# EAGLE design rc2014_16550b (EAGLE 8.1.1)
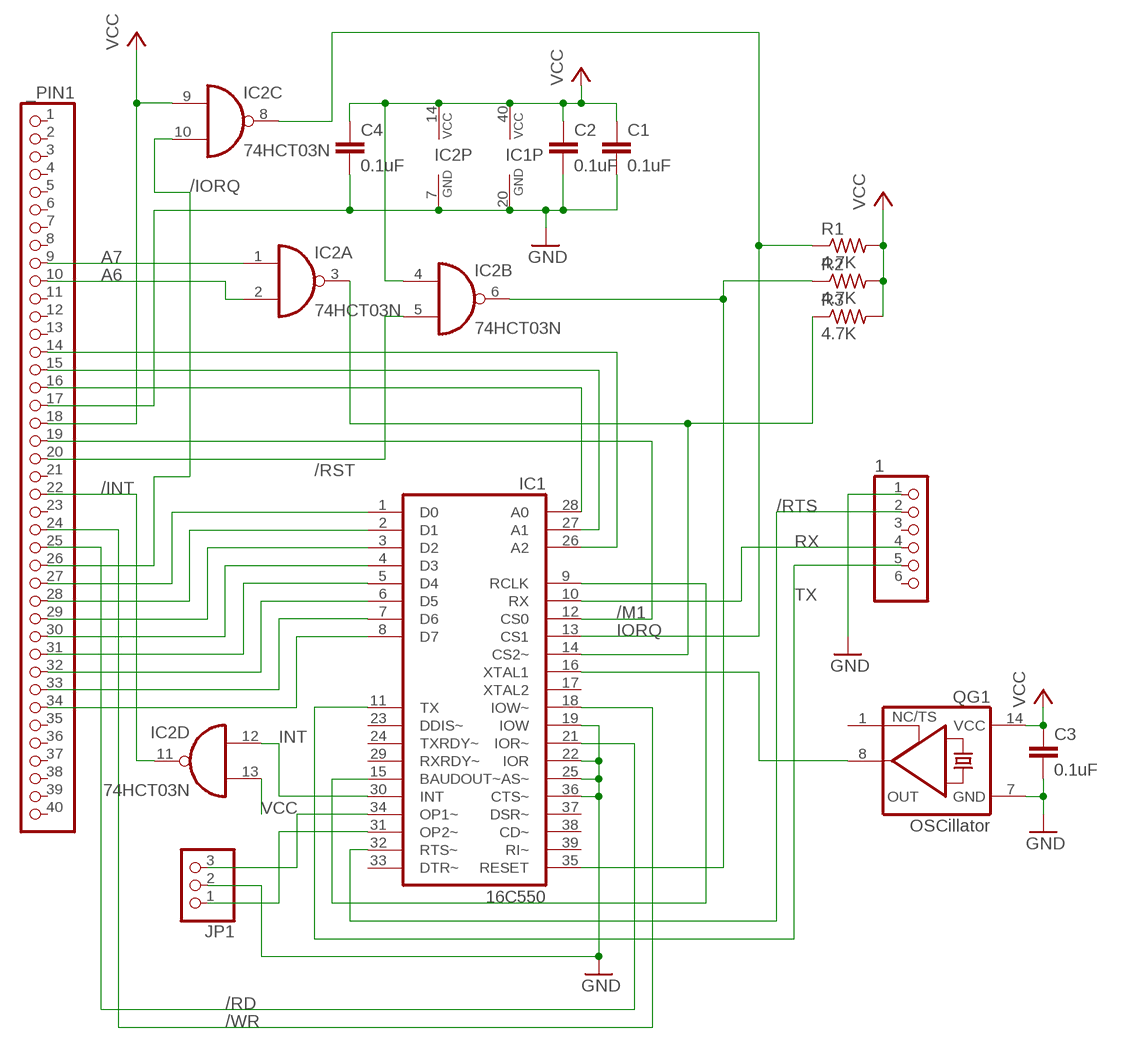
[diagram p0: schematic, sheet 1]

## Parts
1  PINHD-1X6  [1X06]
_PIN1  PINHD-1X40  [1X40]
C1  0.1uF  C-EU050-024X044  [C050-024X044]
C2  0.1uF  C-EU050-024X044  [C050-024X044]
C3  0.1uF  C-EU050-024X044  [C050-024X044]
C4  0.1uF  C-EU050-024X044  [C050-024X044]
IC1  16C550  XR-16C550P  [DIL40]
IC2  74HCT03N  74HCT00N  [DIL14]
JP1  PINHD-1X3  [1X03]
QG1  OSCillator  XO-14  [DIL14S]
R1  4.7K  R-US_0207/10  [0207/10]
R2  4.7K  R-US_0207/10  [0207/10]
R3  4.7K  R-US_0207/10  [0207/10]

## Nets
/CS2: IC1.14(CS2~) IC2.3(A:O) R3.1
/INT: _PIN1.22 IC2.11(D:O)
/IORQ: _PIN1.26 IC2.10(C:I1)
/M1: _PIN1.19 IC1.12(CS0)
/RD: _PIN1.25 IC1.21(IOR~)
/RST: _PIN1.20 IC2.5(B:I1)
/RTS: 1.2 IC1.32(RTS~)
/WR: _PIN1.24 IC1.18(IOW~)
A0: _PIN1.16 IC1.28(A0)
A1: _PIN1.15 IC1.27(A1)
A2: _PIN1.14 IC1.26(A2)
A6: _PIN1.10 IC2.2(A:I1)
A7: _PIN1.9 IC2.1(A:I0)
D0: _PIN1.27 IC1.1(D0)
D1: _PIN1.28 IC1.2(D1)
D2: _PIN1.29 IC1.3(D2)
D3: _PIN1.30 IC1.4(D3)
D4: _PIN1.31 IC1.5(D4)
D5: _PIN1.32 IC1.6(D5)
D6: _PIN1.33 IC1.7(D6)
D7: _PIN1.34 IC1.8(D7)
GND: 1.1 _PIN1.17 C1.2 C2.2 C3.2 C4.2 IC1.19(IOW) IC1.20(GND) IC1.22(IOR) IC1.25(AS~) IC1.36(CTS~) IC2.7(P:GND) JP1.2 QG1.7(GND)
INT: IC1.30(INT) IC2.12(D:I0)
IORQ: IC1.13(CS1) IC2.8(C:O) R1.1
N$1: IC1.34(OP1~) JP1.3
N$2: IC1.31(OP2~) JP1.1
N$14: IC1.9(RCLK) IC1.15(BAUDOUT~)
OSC: IC1.16(XTAL1) QG1.8(OUT)
RESET: IC1.35(RESET) IC2.6(B:O) R2.1
RX: 1.4 IC1.10(RX)
TX: 1.5 IC1.11(TX)
VCC: _PIN1.18 C1.1 C2.1 C3.1 C4.1 IC1.40(VCC) IC2.4(B:I0) IC2.9(C:I0) IC2.13(D:I1) IC2.14(P:VCC) QG1.14(VCC) R1.2 R2.2 R3.2
Unconnected: 1.3 1.6 _PIN1.1 _PIN1.2 _PIN1.3 _PIN1.4 _PIN1.5 _PIN1.6 _PIN1.7 _PIN1.8 _PIN1.11 _PIN1.12 _PIN1.13 _PIN1.21 _PIN1.23 _PIN1.35 _PIN1.36 _PIN1.37 _PIN1.38 _PIN1.39 _PIN1.40 IC1.17(XTAL2) IC1.23(DDIS~) IC1.24(TXRDY~) IC1.29(RXRDY~) IC1.33(DTR~) IC1.37(DSR~) IC1.38(CD~) IC1.39(RI~) QG1.1(TS)

## Library data of the parts
1 = pinhead:PINHD-1X6: PIN HEADER
_PIN1 = pinhead:PINHD-1X40: PIN HEADER
C1-C4 = rcl:C-EU: CAPACITOR, European symbol
IC1 = exar:XR-16C550P: UART/FIFO; MPN: ST16C450CP40; OC_FARNELL: 1294801; OC_NEWARK: 24R1445
IC2 = 74xx-eu:74*00: Quad 2-input NAND gate
JP1 = pinhead:PINHD-1X3: PIN HEADER
QG1 = crystal:XO-: CRYSTAL; OC_FARNELL: unknown; OC_NEWARK: unknown
R1-R3 = rcl:R-US_: RESISTOR, American symbol

## Net classes
0 +5V: width 0.508 mm

## Board
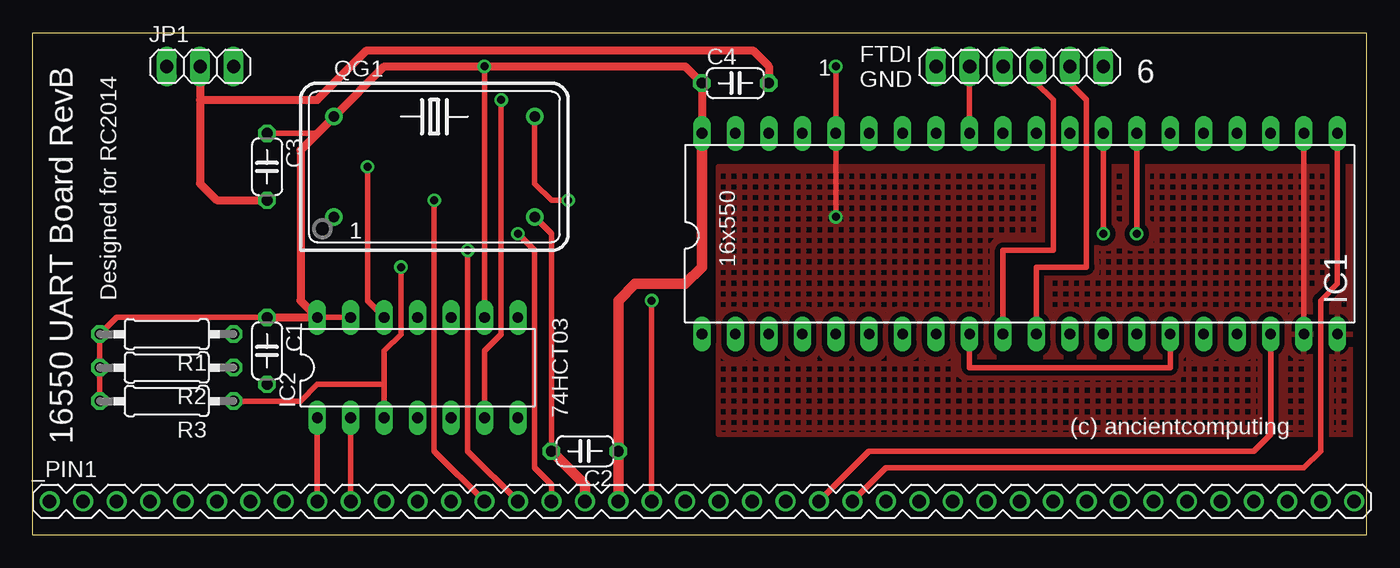
[diagram p1: board, top side]
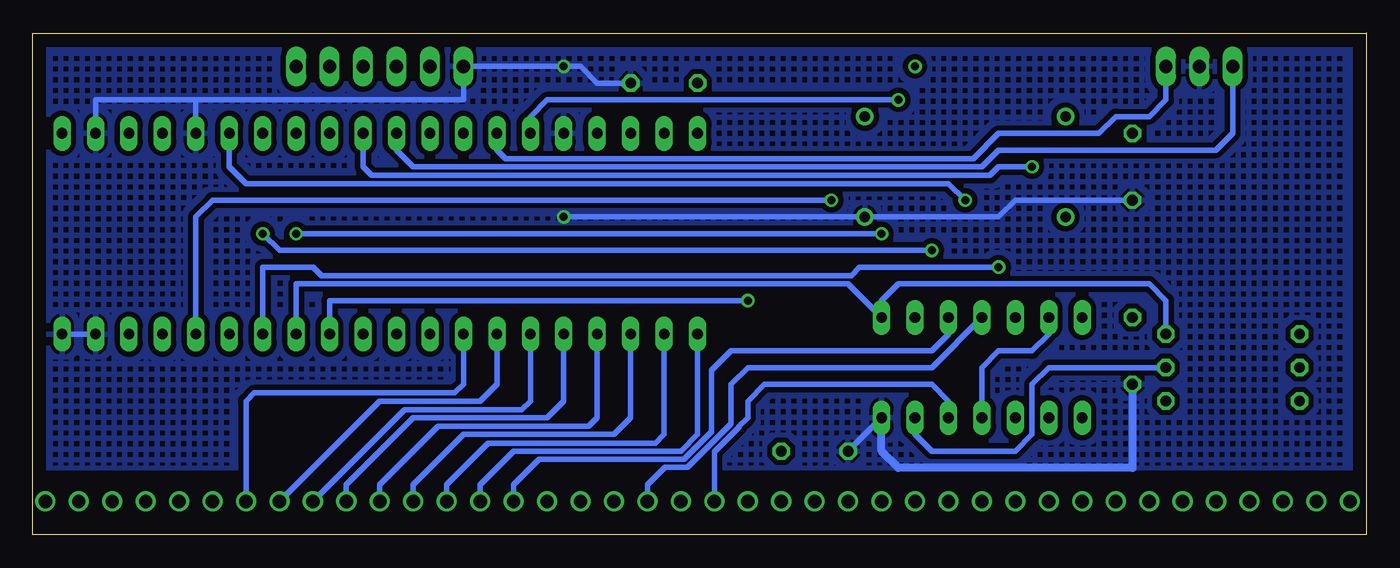
[diagram p2: board, bottom side, seen from below]

Size 101.27 x 38.1 mm. Coordinates in mm from the lower left corner, seen from the top.
Outline: 0,38.09 101.27,38.09 101.27,0 0,0 0,38.09
Outline: 0,38.09 0,38.1
Copper layers (1*16): Top 0.035mm / dielectric 1.5mm / Bottom 0.035mm
Design rules "default *": minimum track width 20mil, minimum drill 24mil, track to track 8mil, track to pad 8mil, pad to pad 8mil, via to via 8mil, smd to smd 8mil, copper to edge 40mil, drill to drill 8mil, minimum pad ring 10mil, minimum via ring 8mil, stop-mask expansion 4mil, vias tented up to drill 0mil, thermal gap 10mil

### Footprints (pad centres in the part's own frame; a part is rotated, then mirrored left to right if it is on the bottom)
1X06 = drill 1.016 long: 1 -6.35,0; 2 -3.81,0; 3 -1.27,0; 4 1.27,0; 5 3.81,0; 6 6.35,0
1X40 = drill 1.016: 1 -49.53,0; 2 -46.99,0; 3 -44.45,0; 4 -41.91,0; 5 -39.37,0; 6 -36.83,0; 7 -34.29,0; 8 -31.75,0; 9 -29.21,0; 10 -26.67,0; 11 -24.13,0; 12 -21.59,0; 13 -19.05,0; 14 -16.51,0; 15 -13.97,0; 16 -11.43,0; 17 -8.89,0; 18 -6.35,0; 19 -3.81,0; 20 -1.27,0; 21 1.27,0; 22 3.81,0; 23 6.35,0; 24 8.89,0; 25 11.43,0; 26 13.97,0; 27 16.51,0; 28 19.05,0; 29 21.59,0; 30 24.13,0; 31 26.67,0; 32 29.21,0; 33 31.75,0; 34 34.29,0; 35 36.83,0; 36 39.37,0; 37 41.91,0; 38 44.45,0; 39 46.99,0; 40 49.53,0
C050-024X044 = drill 0.813 octagon: 1 -2.54,0; 2 2.54,0
DIL40 = drill 0.813 long: 1 -24.13,-7.62; 2 -21.59,-7.62; 3 -19.05,-7.62; 4 -16.51,-7.62; 5 -13.97,-7.62; 6 -11.43,-7.62; 7 -8.89,-7.62; 8 -6.35,-7.62; 9 -3.81,-7.62; 10 -1.27,-7.62; 11 1.27,-7.62; 12 3.81,-7.62; 13 6.35,-7.62; 14 8.89,-7.62; 15 11.43,-7.62; 16 13.97,-7.62; 17 16.51,-7.62; 18 19.05,-7.62; 19 21.59,-7.62; 20 24.13,-7.62; 21 24.13,7.62; 22 21.59,7.62; 23 19.05,7.62; 24 16.51,7.62; 25 13.97,7.62; 26 11.43,7.62; 27 8.89,7.62; 28 6.35,7.62; 29 3.81,7.62; 30 1.27,7.62; 31 -1.27,7.62; 32 -3.81,7.62; 33 -6.35,7.62; 34 -8.89,7.62; 35 -11.43,7.62; 36 -13.97,7.62; 37 -16.51,7.62; 38 -19.05,7.62; 39 -21.59,7.62; 40 -24.13,7.62
DIL14 = drill 0.813 long: 1 -7.62,-3.81; 2 -5.08,-3.81; 3 -2.54,-3.81; 4 0,-3.81; 5 2.54,-3.81; 6 5.08,-3.81; 7 7.62,-3.81; 8 7.62,3.81; 9 5.08,3.81; 10 2.54,3.81; 11 0,3.81; 12 -2.54,3.81; 13 -5.08,3.81; 14 -7.62,3.81
1X03 = drill 1.016 long: 1 -2.54,0; 2 0,0; 3 2.54,0
DIL14S = drill 0.813: 1 -7.62,-3.81; 7 7.62,-3.81; 8 7.62,3.81; 14 -7.62,3.81
0207/10 = drill 0.813 octagon: 1 -5.08,0; 2 5.08,0

### Placement (x,y rotation side)
1  74.93,35.56 0 top
_PIN1  50.8,2.54 0 top
C1  17.78,13.97 270 top
C2  41.91,6.35 180 top
C3  17.78,27.94 270 top
C4  53.34,34.29 0 top
IC1  74.93,22.86 0 top
IC2  74HCT00N  [DIL14]  29.21,12.7 0 top
JP1  12.7,35.56 0 top
QG1  30.48,27.94 0 top
R1  [0207/10]  10.16,15.24 180 top
R2  [0207/10]  10.16,12.7 180 top
R3  [0207/10]  10.16,10.16 180 top

### Tracks (layer width: path | path; a pad name or v marks a point on that pad's centre or on a via)
/CS2  (via drill 0.61)
  Top 0.406: 26.67,11.43 IC2.3 | 26.67,11.43 26.67,13.97 27.94,15.24 v27.94,20.32 | 26.67,11.43 21.59,11.43 20.32,10.16 R3.1
  Bottom 0.406: v27.94,20.32 38.51,20.32 39.12,19.66 79.35,19.66 80.01,20.32 83.82,20.32 IC1.14
/INT
  Bottom 0.406: _PIN1.22 54.61,3.81 53.29,5.13 51.56,5.13 48.26,8.44 48.26,11.43 46.99,12.7 33.02,12.7 IC2.11
/IORQ
  Bottom 0.406: _PIN1.26 64.77,3.81 62.84,5.74 51.82,5.74 49.73,7.83 49.73,12.5 48.26,13.97 33.02,13.97 31.75,15.24 IC2.10
/M1  (via drill 0.61)
  Top 0.406: _PIN1.19 v46.99,17.78
  Bottom 0.406: v46.99,17.78 78.74,17.78 IC1.12
/RD
  Top 0.406: _PIN1.25 64.77,5.08 96.52,5.08 97.79,6.35 97.79,17.78 99.06,19.05 IC1.21
/RST
  Bottom 0.406: _PIN1.20 49.53,6.3 47.65,8.18 47.65,8.23 46.99,8.89 46.99,10.16 45.72,11.43 33.02,11.43 31.75,10.16 IC2.5
/RTS
  Top 0.406: 1.2 IC1.32
/WR
  Top 0.406: _PIN1.24 63.5,6.35 92.71,6.35 93.98,7.62 IC1.18
A0  (via drill 0.61)
  Top 0.406: IC1.28 v81.28,22.86 | _PIN1.16 39.37,3.81 38.1,5.08 38.1,21.59 v36.83,22.86
  Bottom 0.406: v36.83,22.86 v81.28,22.86
A1  (via drill 0.61)
  Top 0.406: IC1.27 v83.82,22.86 | _PIN1.15 33.02,6.35 v33.02,21.59
  Bottom 0.406: v83.82,22.86 82.55,21.59 v33.02,21.59
A2  (via drill 0.61)
  Top 0.406: _PIN1.14 30.48,6.35 v30.48,25.4
  Bottom 0.406: v30.48,25.4 31.75,26.67 85.09,26.67 86.36,27.94 IC1.26
A6
  Top 0.406: _PIN1.10 IC2.2
A7
  Top 0.406: _PIN1.9 IC2.1
D0
  Bottom 0.406: _PIN1.27 67.31,3.81 64.77,6.35 52.07,6.35 50.8,7.62 IC1.1
D1
  Bottom 0.406: IC1.2 53.34,7.62 54,6.96 66.7,6.96 69.85,3.81 _PIN1.28
D2
  Bottom 0.406: IC1.3 55.88,8.89 57.15,7.62 68.58,7.62 72.39,3.81 _PIN1.29
D3
  Bottom 0.406: IC1.4 58.42,8.89 59.08,8.23 70.51,8.23 74.93,3.81 _PIN1.30
D4
  Bottom 0.406: IC1.5 60.96,10.16 62.23,8.89 72.39,8.89 77.47,3.81 _PIN1.31
D5
  Bottom 0.406: IC1.6 63.5,10.16 64.16,9.5 73.05,9.5 _PIN1.32
D6
  Bottom 0.406: IC1.7 66.04,11.43 67.31,10.16 74.93,10.16 _PIN1.33
D7
  Bottom 0.406: IC1.8 68.58,11.43 69.24,10.77 84.48,10.77 85.09,10.16 _PIN1.34
GND  (via drill 0.61)
  Top 0.406: IC1.22 IC1.19 | v60.96,35.56 IC1.36 v60.96,24.13 | QG1.7 39.37,22.86 C2.2
  Top 0.61: JP1.2 12.7,33.02 | 12.7,33.02 12.7,26.67 13.97,25.4 C3.2 | 12.7,33.02 21.59,33.02 25.34,36.77 54.67,36.77 55.88,35.56 C4.2
  Top 0.813: _PIN1.17 41.91,3.81 C2.2
  Bottom 0.406: 88.9,33.02 68.58,33.02 1.1 v60.96,35.56 59.69,35.56 58.42,34.29 C4.2 | 88.9,33.02 IC1.25 | 88.9,33.02 96.52,33.02 IC1.22 | IC1.19 IC1.20 | v60.96,24.13 QG1.7 27.94,24.13 26.67,25.4 C3.2 | IC2.7 C2.2
  Bottom 0.61: C1.2 17.78,5.08 35.56,5.08 36.83,6.35 IC2.7
  pour Bottom (isolate 0.406, hatched): 0,38.1 0,5.08 101.6,5.08 101.6,38.1
  pour Top (isolate 0.406, hatched): 52.07,27.94 52.07,7.62 100.33,7.62 100.33,27.94
INT  (via drill 0.61)
  Top 0.406: v25.4,27.94 25.4,17.78 IC2.12
  Bottom 0.406: 76.2,27.94 IC1.30 76.2,27.94 | 76.2,27.94 75.54,27.28 28.6,27.28 27.94,27.94 v25.4,27.94
IORQ
  Bottom 0.406: R1.1 15.24,17.78 16.51,19.05 35.56,19.05 36.83,17.78 IC2.8 39.37,19.05 81.28,19.05 IC1.13
N$1
  Bottom 0.406: IC1.34 66.04,29.21 65.38,28.55 29.87,28.55 27.94,30.48 20.32,30.48 19.05,31.75 16.51,31.75 15.24,33.02 JP1.3
N$2
  Bottom 0.406: IC1.31 73.66,29.21 72.39,27.94 29.21,27.94 27.94,29.21 11.43,29.21 10.16,30.48 JP1.1
N$14
  Top 0.406: IC1.15 86.36,12.7 71.12,12.7 IC1.9
OSC  (via drill 0.61)
  Top 0.406: QG1.8 38.1,26.67 39.37,25.4 v40.64,25.4
  Bottom 0.406: v40.64,25.4 87.63,25.4 88.9,24.13 IC1.16
RESET  (via drill 0.61)
  Top 0.406: IC2.6 34.29,13.97 35.56,15.24 v35.56,33.02
  Bottom 0.406: v35.56,33.02 62.23,33.02 63.5,31.75 IC1.35 | R2.1 24.13,12.7 25.4,11.43 25.4,7.62 26.67,6.35 33.02,6.35 34.29,7.62 IC2.6
RX
  Top 0.406: 1.4 76.2,34.29 77.47,33.02 77.47,21.59 73.66,21.59 IC1.10
TX
  Top 0.406: 1.5 78.74,34.29 80.01,33.02 80.01,20.32 76.2,20.32 IC1.11
VCC  (via drill 0.61)
  Top 0.406: IC2.9 v34.29,35.56 | C3.1 21.59,30.48 QG1.14 | IC2.14 IC2.13 | R3.2 R2.2 R1.2 6.35,16.51 C1.1
  Top 0.61: IC1.40 C4.1 49.53,35.56 v34.29,35.56 26.67,35.56 QG1.14 20.32,29.21 20.32,17.78 IC2.14 C1.1
  Top 0.813: _PIN1.18 C2.1 44.45,17.78 45.72,19.05 49.53,19.05 50.8,20.32 IC1.40
  Bottom 0.406: IC2.13 24.13,15.24 25.4,13.97 27.94,13.97 29.21,12.7 IC2.4

### Text on the board
tNames: 16550 UART Board RevB | FTDI / GND | 6 | 16x550 | Designed for RC2014 | 74HCT03 | (c) ancientcomputing